# Altium project 5.0inch_IPS_for_TerasicDEs.PrjPCB
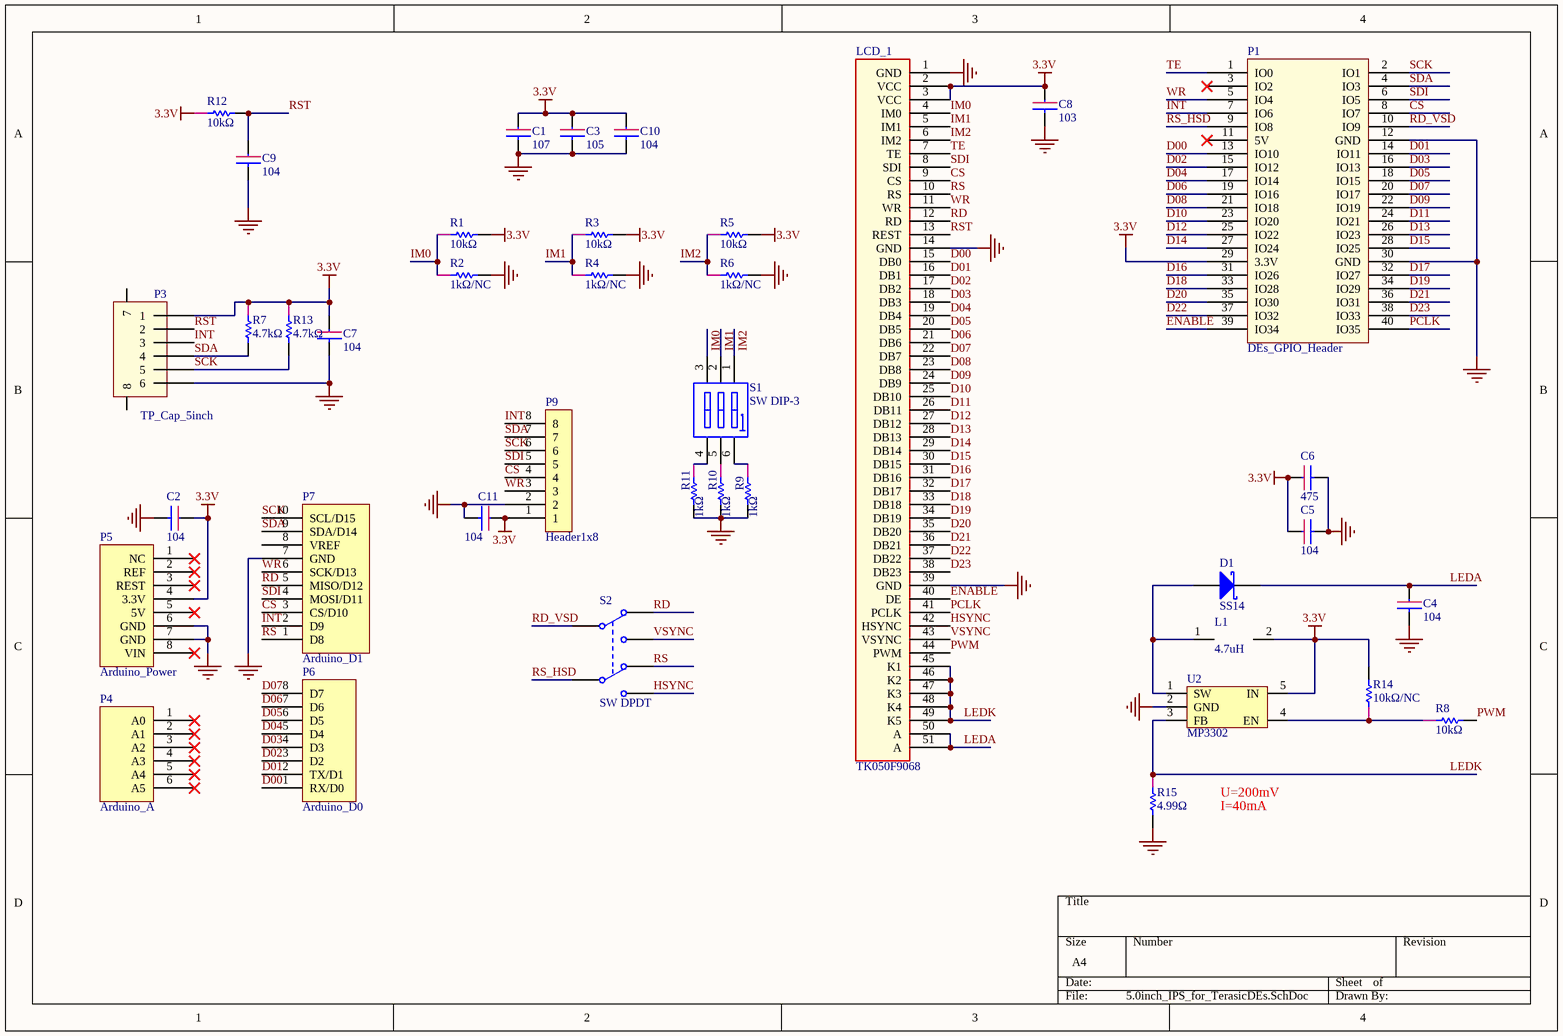
[diagram p0: 5.0inch_IPS_for_TerasicDEs.SchDoc]
1 sheet, 39 parts. Net scope: global (net labels, ports and power ports of the same name join across sheets).
Board file: 5.0inch_IPS_for_TerasicDEs.PcbDoc

## Sheet 5.0inch_IPS_for_TerasicDEs.SchDoc
size A4

### Parts
C1  107  [C3528B]
C2  104  [C0603-2]
C3  105  [C3216A]
C4  104  [C0603-2]
C5  104  [C0603-1]
C6  475  [C0603-2]
C7  104  [C0603-1]
C8  103  [C0603-1]
C9  104  [C0603-2]
C10  104  [C0603-1]
C11  104  [C0603-2]
D1  SS14  [SOD123]
L1  4.7uH  [L453226]
LCD_1  TK050F9068  [TK050F5590]
P1  DEs_GPIO_Header  [P_HEAD_2X20-n]
P3  TP_Cap_5inch  [TP_CAP_5INCH]
P4  Arduino_A  [SMT_Pin1x6C]
P5  Arduino_Power  [SMT_Pin1x8C]
P6  Arduino_D0  [SMT_Pin1x8C]
P7  Arduino_D1  [SMT_Pin1x10C]
P9  Header1x8  [SMT_Pin1x8]
R1  10kΩ  [R0603]
R2  1kΩ/NC  [R0603]
R3  10kΩ  [R0603]
R4  1kΩ/NC  [R0603]
R5  10kΩ  [R0603]
R6  1kΩ/NC  [R0603]
R7  4.7kΩ  [R0603]
R8  10kΩ  [R0603]
R9  1kΩ  [R0603]
R10  1kΩ  [R0603]
R11  1kΩ  [R0603]
R12  10kΩ  [R0603]
R13  4.7kΩ  [R0603]
R14  10kΩ/NC  [R0603]
R15  4.99Ω  [R0603]
S1  SW DIP-3  [DIP3-1.27]
S2  SW DPDT  [MSS-22C02]
U2  MP3302  [SOT23-5]

### Nets
3.3V: C1.1 C2.1 C3.1 C5.1 C6.1 C7.1 C8.1 C10.1 C11.1 L1.2 LCD_1.2(VCC) LCD_1.3(VCC) P1.29(3.3V) P3.1 P5.4(3.3V) P9.1 R1.2 R3.2 R5.2 R7.1 R12.1 R13.1 R14.2 U2.5(IN)
GND: C1.2 C2.2 C3.2 C4.2 C5.2 C6.2 C7.2 C8.2 C9.2 C10.2 C11.2 LCD_1.1(GND) LCD_1.14(GND) LCD_1.39(GND) P1.12(GND) P1.30(GND) P3.6 P5.6(GND) P5.7(GND) P7.7(GND) P9.2 R2.2 R4.2 R6.2 R9.2 R10.2 R11.2 R15.2 U2.2(GND)
CS: LCD_1.9(CS) P1.8(IO7) P7.3(CS/D10) P9.4
D00: LCD_1.15(DB0) P1.13(IO10) P6.1(RX/D0)
D01: LCD_1.16(DB1) P1.14(IO11) P6.2(TX/D1)
D02: LCD_1.17(DB2) P1.15(IO12) P6.3(D2)
D03: LCD_1.18(DB3) P1.16(IO13) P6.4(D3)
D04: LCD_1.19(DB4) P1.17(IO14) P6.5(D4)
D05: LCD_1.20(DB5) P1.18(IO15) P6.6(D5)
D06: LCD_1.21(DB6) P1.19(IO16) P6.7(D6)
D07: LCD_1.22(DB7) P1.20(IO17) P6.8(D7)
D08: LCD_1.23(DB8) P1.21(IO18)
D09: LCD_1.24(DB9) P1.22(IO19)
D10: LCD_1.25(DB10) P1.23(IO20)
D11: LCD_1.26(DB11) P1.24(IO21)
D12: LCD_1.27(DB12) P1.25(IO22)
D13: LCD_1.28(DB13) P1.26(IO23)
D14: LCD_1.29(DB14) P1.27(IO24)
D15: LCD_1.30(DB15) P1.28(IO25)
D16: LCD_1.31(DB16) P1.31(IO26)
D17: LCD_1.32(DB17) P1.32(IO27)
D18: LCD_1.33(DB18) P1.33(IO28)
D19: LCD_1.34(DB19) P1.34(IO29)
D20: LCD_1.35(DB20) P1.35(IO30)
D21: LCD_1.36(DB21) P1.36(IO31)
D22: LCD_1.37(DB22) P1.37(IO32)
D23: LCD_1.38(DB23) P1.38(IO33)
ENABLE: LCD_1.40(DE) P1.39(IO34)
HSYNC: LCD_1.42(HSYNC) S2.4(NO2)
IM0: LCD_1.4(IM0) R1.1 R2.1 S1.3(A3)
IM1: LCD_1.5(IM1) R3.1 R4.1 S1.2(A2)
IM2: LCD_1.6(IM2) R5.1 R6.1 S1.1(A1)
INT: P1.7(IO6) P3.3 P7.2(D9) P9.8
LEDA: C4.1 D1.2(K) LCD_1.50(A) LCD_1.51(A)
LEDK: LCD_1.45(K1) LCD_1.46(K2) LCD_1.47(K3) LCD_1.48(K4) LCD_1.49(K5) R15.1 U2.3(FB)
PCLK: LCD_1.41(PCLK) P1.40(IO35)
PWM: LCD_1.44(PWM) R8.2
RD: LCD_1.12(RD) P7.5(MISO/D12) S2.1(NC1)
RD_VSD: P1.10(IO9) S2.2(COMMON1)
RS: LCD_1.10(RS) P7.1(D8) S2.6(NC2)
RS_HSD: P1.9(IO8) S2.5(COMMON2)
RST: C9.1 LCD_1.13(REST) P3.2 R12.2
SCK: P1.2(IO1) P3.5 P7.10(SCL/D15) P9.6 R13.2
SDA: P1.4(IO3) P3.4 P7.9(SDA/D14) P9.7 R7.2
SDI: LCD_1.8(SDI) P1.6(IO5) P7.4(MOSI/D11) P9.5
TE: LCD_1.7(TE) P1.1(IO0)
VSYNC: LCD_1.43(VSYNC) S2.3(NO1)
WR: LCD_1.11(WR) P1.5(IO4) P7.6(SCK/D13) P9.3
NetD1_1: D1.1(A) L1.1 U2.1(SW)
NetR8_1: R8.1 R14.1 U2.4(EN)
NetR9_1: R9.1 S1.6(B1)
NetR10_1: R10.1 S1.5(B2)
NetR11_1: R11.1 S1.4(B3)

Not connected (* = marked no-connect by the designer): P1 3(IO2)* 11(5V)*; P3 7 8; P4 1(A0)* 2(A1)* 3(A2)* 4(A3)* 5(A4)* 6(A5)*; P5 1(NC)* 2(REF)* 3(REST)* 5(5V)* 8(VIN)*; P7 8(VREF)

### Notes on the sheet
- U=200mV
- I=40mA

### Library data of the parts
C1-C11 = cap
D1 = D Schottky: Schottky Diode; Published: 8-Jun-2000; LatestRevisionDate: 17-Jul-2002; LatestRevisionNote: Re-released for DXP Platform.; PackageReference: SMB; Publisher: Altium Limited; PackageDescription: DO-214-AA/SMB; 2 C-Bend Leads; Body 5.3 x 3.6 mm, inc. leads (LxW); Code_JEDEC: DO-214-AA
L1 = Inductor
P3 = BHEADSMD1x6
R1-R15 = Resistor
S1 = SW DIP-3: DIP Switch, 3 Position, SPST; Published: 24-Mar-1999; LatestRevisionDate: 17-Jul-2002; LatestRevisionNote: Re-released for DXP Platform.; PackageReference: DIP-6; Publisher: Altium Limited; Code_JEDEC: MO-001-AM
S2 = SW DPDT: Switch; Published: 24-Mar-1999; LatestRevisionDate: 29-May-2009; LatestRevisionNote: IPC-7351 Footprint Added.; PackageVersion: Mar-2001; PackageReference: SOT23-6; Publisher: Altium Limited; PackageDescription: 6-Pin SOT-23 Package 0.95 mm Pitch, 2.7 mm Lead Span; Code_JEITA: SC-74; Code_IPC: SOT26A-6